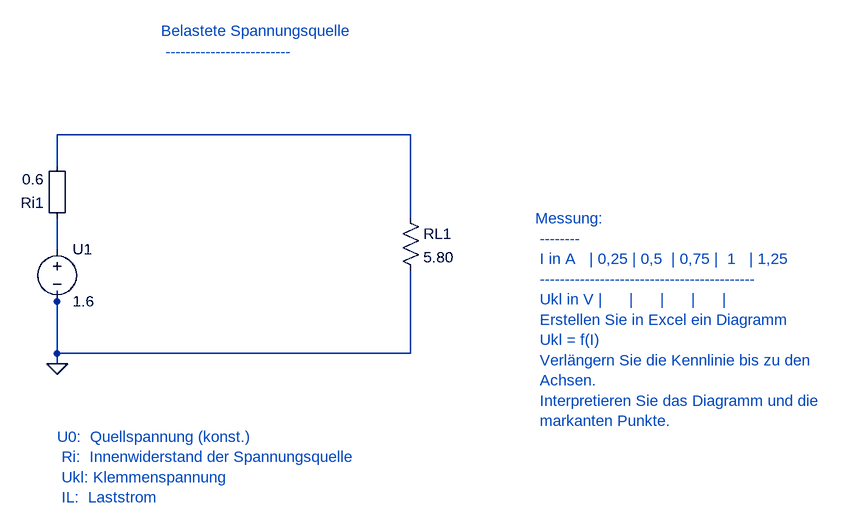
[diagram p0: schematic 1_2_2_Belastete_Spannungsquelle.asc]
1_2_2_Belastete_Spannungsquelle.asc, the LTspice schematic file:
Version 4
SHEET 1 880 680
WIRE 160 544 160 528
WIRE 160 416 160 464
WIRE 160 528 160 624
WIRE 704 416 704 288
WIRE 704 288 160 288
WIRE 160 288 160 336
WIRE 160 624 160 640
WIRE 704 496 704 624
WIRE 704 624 160 624
FLAG 160 640 0
SYMBOL voltage 160 448 R0
SYMATTR InstName U1
SYMATTR Value 1.6
SYMBOL Misc\EuropeanResistor 176 432 R180
SYMATTR InstName Ri1
SYMATTR Value 0.6
SYMBOL res 688 400 R0
SYMATTR InstName RL1
SYMATTR Value 5.80
TEXT 320 128 Left 2 ;Belastete Spannungsquelle \n -------------------------
TEXT 896 416 Left 2 ;Messung: \n -------- \n I in A   | 0,25 | 0,5  | 0,75 |  1   | 1,25 \n ------------------------------------------- \n Ukl in V |      |      |      |      | \n Erstellen Sie in Excel ein Diagramm \n Ukl = f(I) \n Verlängern Sie die Kennlinie bis zu den \n Achsen. \n Interpretieren Sie das Diagramm und die \n markanten Punkte.
TEXT 160 752 Left 2 ;U0:  Quellspannung (konst.) \n Ri:  Innenwiderstand der Spannungsquelle \n Ukl: Klemmenspannung \n IL:  Laststrom

The netlist it stands for:
* 1_2_2_Belastete_Spannungsquelle.asc
V§U1 N001 0 1.6
Ri1 N001 N002 0.6
RL1 N002 0 5.80
* Belastete Spannungsquelle
*  -------------------------
* Messung:
*  --------
*  I in A   | 0,25 | 0,5  | 0,75 |  1   | 1,25
*  -------------------------------------------
*  Ukl in V |      |      |      |      |
*  Erstellen Sie in Excel ein Diagramm
*  Ukl = f(I)
*  Verlängern Sie die Kennlinie bis zu den
*  Achsen.
*  Interpretieren Sie das Diagramm und die
*  markanten Punkte.
* U0:  Quellspannung (konst.)
*  Ri:  Innenwiderstand der Spannungsquelle
*  Ukl: Klemmenspannung
*  IL:  Laststrom
.backanno
.end